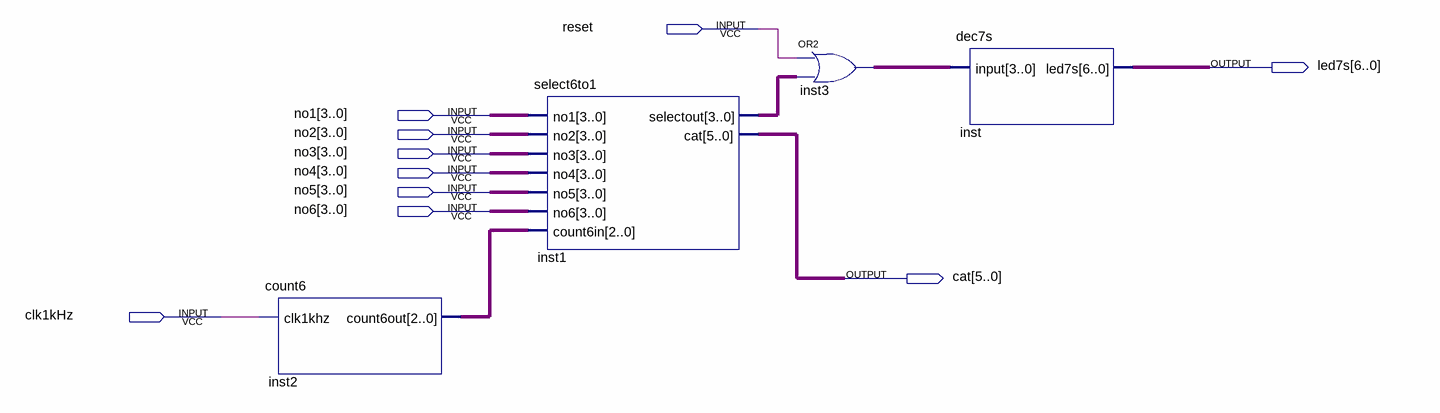
[diagram p0: schematic sheet]
// Quartus schematic shumaguan.bdf as structural Verilog: 4 symbols, 10 pins
module shumaguan (
  input  reset,
  input  [3:0] no1,
  input  [3:0] no2,
  input  [3:0] no3,
  input  [3:0] no4,
  input  [3:0] no5,
  input  [3:0] no6,
  input  clk1kHz,
  output [6:0] led7s,
  output [5:0] cat
);

  wire [2:0] inst2_count6out;
  wire [3:0] inst1_selectout, inst3_out;

  count6 inst2 (.clk1khz(clk1kHz), .count6out(inst2_count6out));
  select6to1 inst1 (
    .no1(no1), .no2(no2), .no3(no3), .no4(no4), .no5(no5), .no6(no6), .count6in(inst2_count6out),
    .selectout(inst1_selectout), .cat(cat));
  assign inst3_out = {4{reset}} | inst1_selectout;  // OR2 inst3, 4 bits wide
  dec7s inst (.\input (inst3_out), .led7s(led7s));
endmodule
